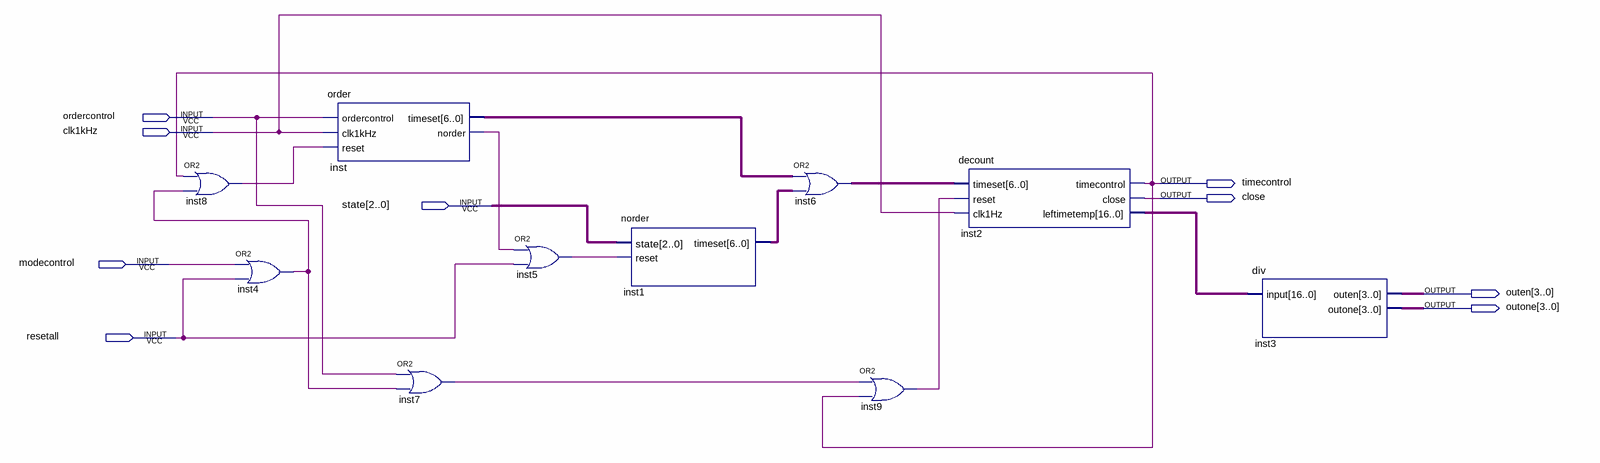
[diagram p0: schematic sheet]
// Quartus schematic ordermode.bdf as structural Verilog: 10 symbols, 9 pins
module ordermode (
  input  ordercontrol,
  input  clk1kHz,
  input  [2:0] state,
  input  modecontrol,
  input  resetall,
  output timecontrol,
  output close,
  output [3:0] outen,
  output [3:0] outone
);

  wire inst4_out, inst5_out, inst7_out, inst8_out, inst9_out, inst_norder;
  wire [6:0] inst1_timeset, inst6_out, inst_timeset;
  wire [16:0] inst2_leftimetemp;

  or inst8 (inst8_out, timecontrol, inst4_out);
  or inst4 (inst4_out, modecontrol, resetall);
  order inst (
    .ordercontrol(ordercontrol), .clk1kHz(clk1kHz), .reset(inst8_out), .timeset(inst_timeset),
    .norder(inst_norder));
  or inst7 (inst7_out, ordercontrol, inst4_out);
  or inst5 (inst5_out, inst_norder, resetall);
  norder inst1 (.state(state), .reset(inst5_out), .timeset(inst1_timeset));
  assign inst6_out = inst_timeset | inst1_timeset;  // OR2 inst6, 7 bits wide
  or inst9 (inst9_out, inst7_out, timecontrol);
  decount inst2 (
    .timeset(inst6_out), .reset(inst9_out), .clk1Hz(clk1kHz), .timecontrol(timecontrol), .close(close),
    .leftimetemp(inst2_leftimetemp));
  div inst3 (.\input (inst2_leftimetemp), .outen(outen), .outone(outone));
endmodule
